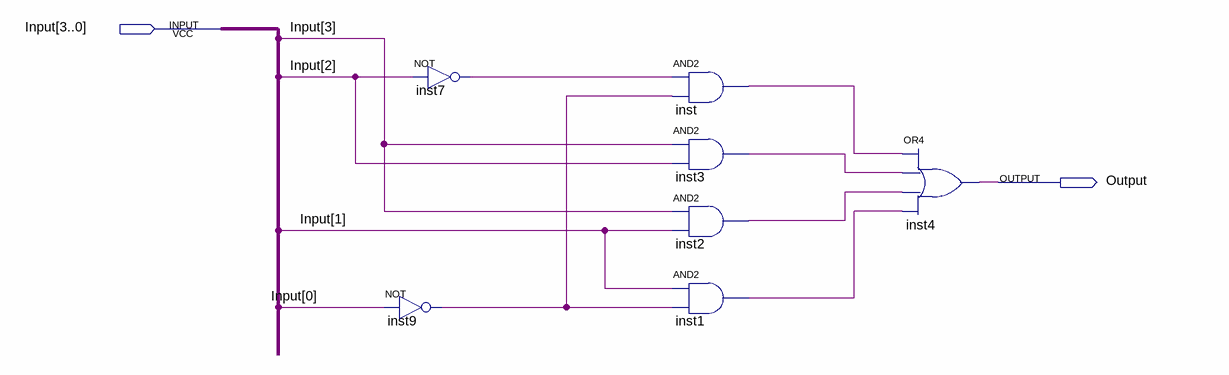
[diagram p0: schematic sheet]
// Quartus schematic display_e.bdf as structural Verilog: 7 symbols, 2 pins
module display_e (
  input  [3:0] Input,
  output Output
);

  wire inst1_out, inst2_out, inst3_out, inst7_out, inst9_out, inst_out;

  not inst7 (inst7_out, Input[2]);
  not inst9 (inst9_out, Input[0]);
  and inst (inst_out, inst7_out, inst9_out);
  and inst3 (inst3_out, Input[3], Input[2]);
  and inst2 (inst2_out, Input[3], Input[1]);
  and inst1 (inst1_out, Input[1], inst9_out);
  or inst4 (Output, inst_out, inst3_out, inst2_out, inst1_out);
endmodule
